# EAGLE schematic schematics (EAGLE 7.2.0)
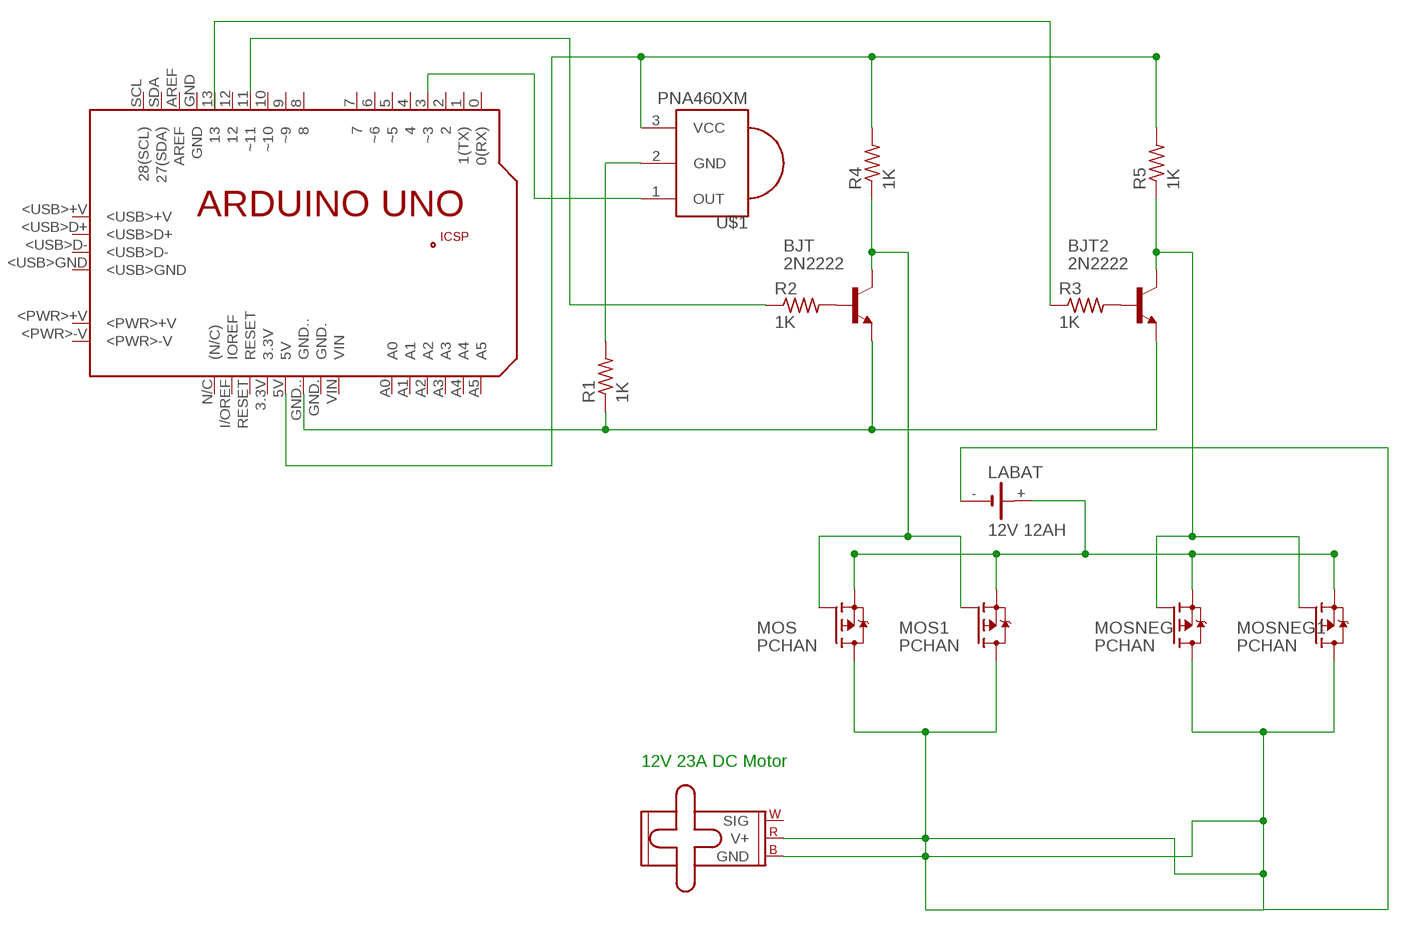
[diagram p0: schematic, sheet 1]

## Parts
BJT  2N2222  [TO92-EBC-OVAL]
BJT2  2N2222  [TO92-EBC-OVAL]
DCMOTOR  12V 23A  SMALL_SERVO  [1X03]
LABAT  12V 12AH  SL-160AA/PR  [SL-160AA/PR]
MOS  PCHAN  FDD4141TO252  [TO252]
MOS1  PCHAN  FDD4141TO252  [TO252]
MOSNEG  PCHAN  FDD4141TO252  [TO252]
MOSNEG1  PCHAN  FDD4141TO252  [TO252]
PCB1  ARDUINO_UNO  [ARDUINO_UNO]
R1  1K  R-US_0207/7  [0207/7]
R2  1K  R-US_0207/7  [0207/7]
R3  1K  R-US_0207/7  [0207/7]
R4  1K  R-US_0207/7  [0207/7]
R5  1K  R-US_0207/7  [0207/7]
U$1  PNA460XM  [PNA460XM]

## Nets
N$1: BJT2.E BJT.E PCB1.GND.. R1.1
N$2: PCB1.5V R4.2 R5.2 U$1.3(VCC)
N$3: PCB1.3(~3) U$1.1(OUT)
N$4: R1.2 U$1.2(GND)
N$5: BJT2.B R3.2
N$6: BJT.B R2.2
N$7: PCB1.11(~11) R2.1
N$8: R3.1
N$9: BJT.C MOS1.1(G) MOS.1(G) R4.1
N$10: BJT2.C MOSNEG1.1(G) MOSNEG.1(G) R5.1
N$11: LABAT.+ MOS1.2(S) MOS.2(S) MOSNEG1.2(S) MOSNEG.2(S)
N$13: DCMOTOR.2(V+) DCMOTOR.3(GND) LABAT.- MOS1.3(D) MOS.3(D) MOSNEG1.3(D) MOSNEG.3(D)
Unconnected: DCMOTOR.1(SIG) PCB1.0(0(RX)) PCB1.1(1(TX)) PCB1.2 PCB1.3.3V PCB1.4 PCB1.5(~5) PCB1.6(~6) PCB1.7 PCB1.8 PCB1.9(~9) PCB1.10(~10) PCB1.12 PCB1.13 PCB1.+5V PCB1.<PWR>+V PCB1.<PWR>-V PCB1.<USB>+V PCB1.<USB>D+ PCB1.<USB>D- PCB1.<USB>GND PCB1.A0 PCB1.A1 PCB1.A2 PCB1.A3 PCB1.A4 PCB1.A5 PCB1.AREF PCB1.GND PCB1.GND. PCB1.GND_ PCB1.I/OREF(IOREF) PCB1.MISO PCB1.MOSI PCB1.N/C((N/C)) PCB1.RESET PCB1.RESET. PCB1.SCK PCB1.SCL(28(SCL)) PCB1.SDA(27(SDA)) PCB1.VIN

## Notes on the sheet
- 12V 23A DC Motor

## Library data of the parts
BJT BJT2 = adafruit:2N2222: NPN TRANSISTOR Big oval pads
DCMOTOR = SparkFun-Electromechanical:SMALL_SERVO: Small servo motor This is the small servo used in the SIK. SKU: ROB-09065
LABAT = battery:SL-160AA/PR: LI BATTERY Sonnenschein
MOS MOS1 MOSNEG MOSNEG1 = transistor-fet:FDD4141: P-Channel PowerTrench® MOSFET Source: FDD4141.pdf
PCB1 = E14_Arduino_published:ARDUINO_UNO: Device for representing an Arduino Uno board with a footprint in an EAGLE design. Created by Dave Young for Element14. More EAGLE documentation at: http://www.element14.com/community/community/knode/cadsoft_eagle
R1-R5 = adafruit:R-US_: RESISTOR, American symbol
U$1 = adafruit:PNA460XM: IR 38KHz receiver PNA4602 and related receivers http://www.ladyada.net/library/pcb/eaglelibrary.html